# EAGLE design miniprinter y motor (EAGLE 9.4.2)
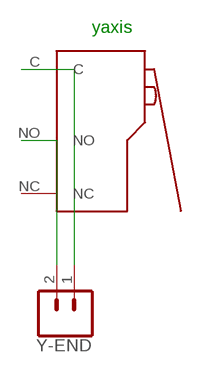
[diagram p0: schematic, sheet 1]

## Parts
U$1  Lever Microswitch Leftangle PCB mount, with Roller style lever, with a red roller  LEVERMICROPCBLEFTANGLE  [LEVERMICROPCB-LEFTANGLE]
Y-END  CONN_023.5MM_LOCK  [SCREWTERMINAL-3.5MM-2_LOCK]

## Nets
N$56: U$1.C Y-END.1
N$57: U$1.NO Y-END.2
Unconnected: U$1.NC

## Notes on the sheet
- yaxis

## Library data of the parts
U$1 = Lever Microswitch Right Angle:LEVERMICROPCB
Y-END = SparkFun-Connectors:CONN_02: Multi connection point. Often used as Generic Header-pin footprint for 0.1 inch spaced/style header connections On any of the 0.1 inch spaced packages, you can populate with these: Break Away Headers - Straight <https://www.sparkfun.com/products/116> (PRT-00116) Break Away Male Headers - Right Angle <https://www.sparkfun.com/products/553> (PRT-00553) Female Headers <https://www.sparkfun.com/products/115> (PRT-00115) Break Away Headers - Machine Pin <https://www.sparkfun.com/products/117> (PRT-00117) Break Away Female Headers - Swiss Machine Pin <https://www.sparkfun.com/products/743> (PRT-00743) For SCREWTERMINALS and SPRING TERMINALS visit here: Screw Terimnals on SparkFun.com <https://www.sparkfun.com/search/results?term=Screw+Terminals> (5mm/3.5mm/2.54mm spacing) This device is also useful as a general connection point to wire up your design to another part of your project. Our various solder wires solder well into these plated through hole pads. Hook-Up Wire - Assortment (Stranded, 22 AWG) <https://www.sparkfun.com/products/11375> (PRT-11375) Hook-Up Wire - Assortment (Solid Core, 22 AWG) <https://www.sparkfun.com/products/11367> (PRT-11367) View the entire wire category on our website here <https://www.sparkfun.com/categories/141> Special notes: Molex polarized connector foot print use with: PRT-08233 with associated crimp pins and housings. 2.54_SCREWTERM for use with PRT-10571. 3.5mm Screw Terminal footprints for PRT-08084 5mm Screw Terminal footprints for use with PRT-08432; PROD_ID: CONN-08399

## Net classes
0 default: width 0.203 mm, clearance 0.152 mm

## Board
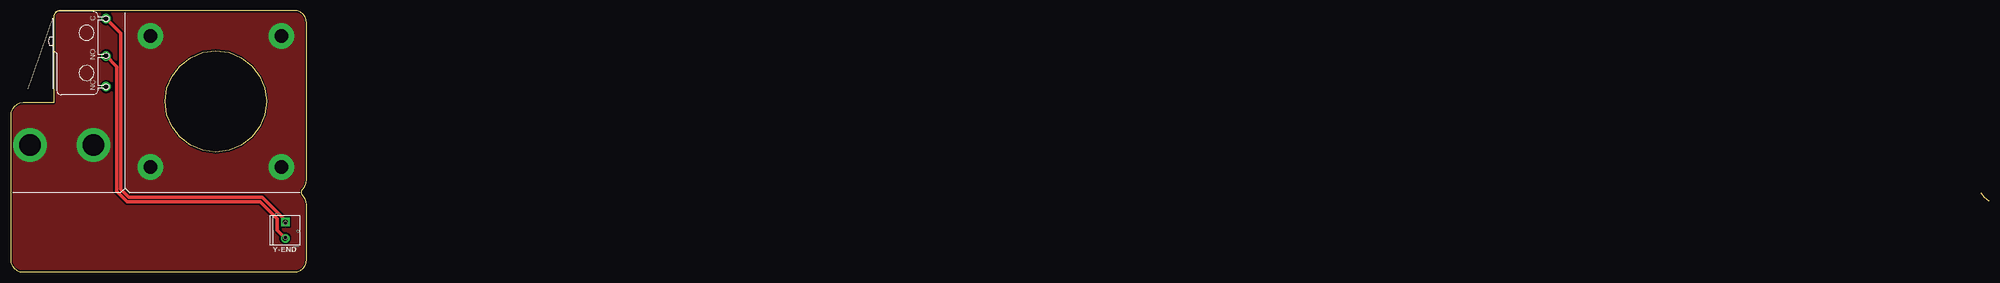
[diagram p1: board, top side]
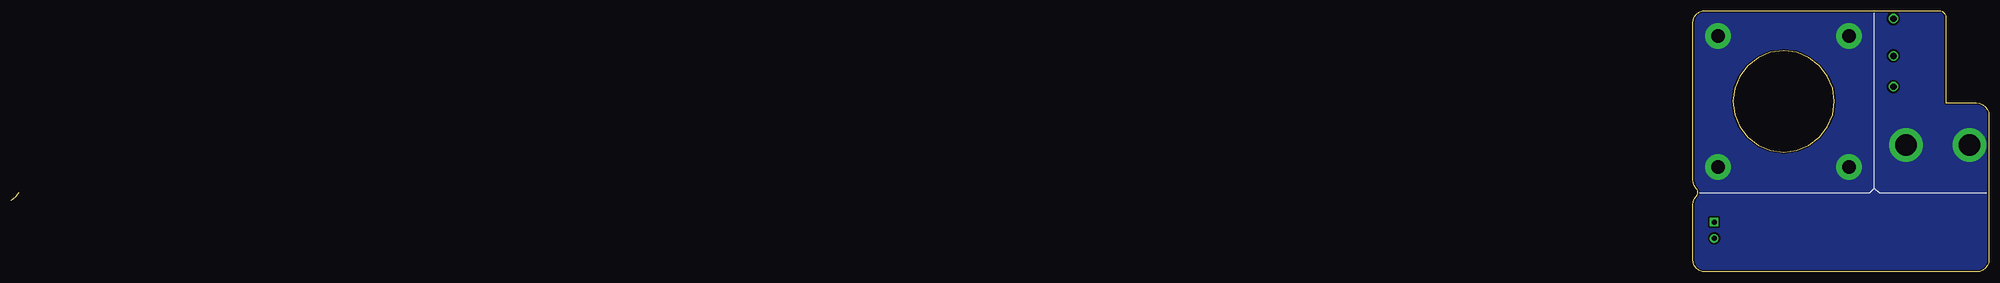
[diagram p2: board, bottom side, seen from below]

Size 468.18 x 61.85 mm. Coordinates in mm from the lower left corner, seen from the top.
Outline: 466.3,18.7 467.12,17.64 468.19,16.82
Outline: 67.1,61.85 11.8,61.85 11.39,61.79 11,61.63 10.67,61.38 10.41,61.05 10.25,60.66 10.2,60.25 10.2,40 3,40 2.22,39.9 1.5,39.6 0.88,39.12 0.4,38.5 0.1,37.78 0,37 0,3 0.1,2.22 0.4,1.5 0.88,0.88 1.5,0.4 2.22,0.1 3,0 67.1,0 67.88,0.1 68.6,0.4 69.22,0.88 69.7,1.5 70,2.22 70.1,3 70.1,15.85 70,16.62 69.7,17.35 69.22,17.97 69.02,18.22 68.9,18.52 68.86,18.85 68.9,19.17 69.02,19.47 69.22,19.72 69.7,20.35 70,21.07 70.1,21.85 70.1,58.85 70,59.62 69.7,60.35 69.22,60.97 68.6,61.44 67.88,61.74 67.1,61.85
Outline: 36.6,40.35 37.01,43.45 38.21,46.35 40.12,48.83 42.6,50.74 45.49,51.94 48.6,52.35 51.71,51.94 54.6,50.74 57.09,48.83 58.99,46.35 60.19,43.45 60.6,40.35 60.19,37.24 58.99,34.35 57.09,31.86 54.6,29.95 51.71,28.75 48.6,28.35 45.49,28.75 42.6,29.95 40.12,31.86 38.21,34.35 37.01,37.24 36.6,40.35
Copper layers (1*16): Top 0.035mm / dielectric 1.5mm / Bottom 0.035mm
Design rules "default *": minimum track width 6mil, minimum drill 0.35mm, track to track 6mil, track to pad 6mil, pad to pad 6mil, via to via 6mil, smd to smd 6mil, copper to edge 10mil, drill to drill 6mil, minimum pad ring 10mil, minimum via ring 8mil, stop-mask expansion 4mil, vias tented up to drill 0mil, thermal gap 10mil

### Footprints (pad centres in the part's own frame; a part is rotated, then mirrored left to right if it is on the bottom)
LEVERMICROPCB-LEFTANGLE = drill 1.5: C 7.3,-7.1; NC -8.8,-7.1; NO -1.5,-7.1
SCREWTERMINAL-3.5MM-2_LOCK = drill 1.2 pad 2.032 square: 1 -0.178,0 | drill 1.2 pad 2.032: 2 3.678,0

### Placement (x,y rotation side)
U$1  15.5,52.63 90 top
Y-END  65,11.63 270 top

### Tracks (layer width: path | path; a pad name or v marks a point on that pad's centre or on a via)
N$56
  Top 0.813: U$1.C 26.1,56.43 26.1,19.53 28,17.63 59.6,17.63 65,12.23 Y-END.1
N$57
  Top 0.813: Y-END.2 63.1,9.85 63.1,12.63 59.06,16.66 27.6,16.66 25.13,19.13 25.13,48.59 U$1.NO
YMOTORGND  (via drill 3.2 pad 6, 5.1 pad 8)
  other vias: 64.1,55.83 64.1,24.83 33.1,24.83 33.1,55.83 19.6,30.03 4.6,30.03
  pour Bottom (isolate 0.406): 67.8,62.13 70.1,59.83 70.1,1.93 68.2,0.03 1.9,0.03 0.1,1.83 0.1,38.03 2.1,40.03 9.8,40.03 10,40.23 10,60.63 11.2,61.83 67.5,61.83
  pour Top (isolate 0.406): 67.8,62.03 70.1,59.73 70.1,1.83 68.2,-0.07 1.9,-0.07 0.1,1.73 0.1,37.93 2.1,39.93 9.8,39.93 10,40.13 10,60.53 11.2,61.73 67.5,61.73